# EasyEDA Pro project CHM_A_32 ver1.1.eprj

# Schematic CHM_A_32 ver1.1
Create Date: 2024-05-28; Page Name: CHM_A_32 ver1.1; Project Name: CHM_A_32 ver1.1; Schematic Name: CHM_A_32 ver1.1; Update Date: 2024-06-17; Company: 嘉立创EDA; Page Size: A4; Version: V1.0
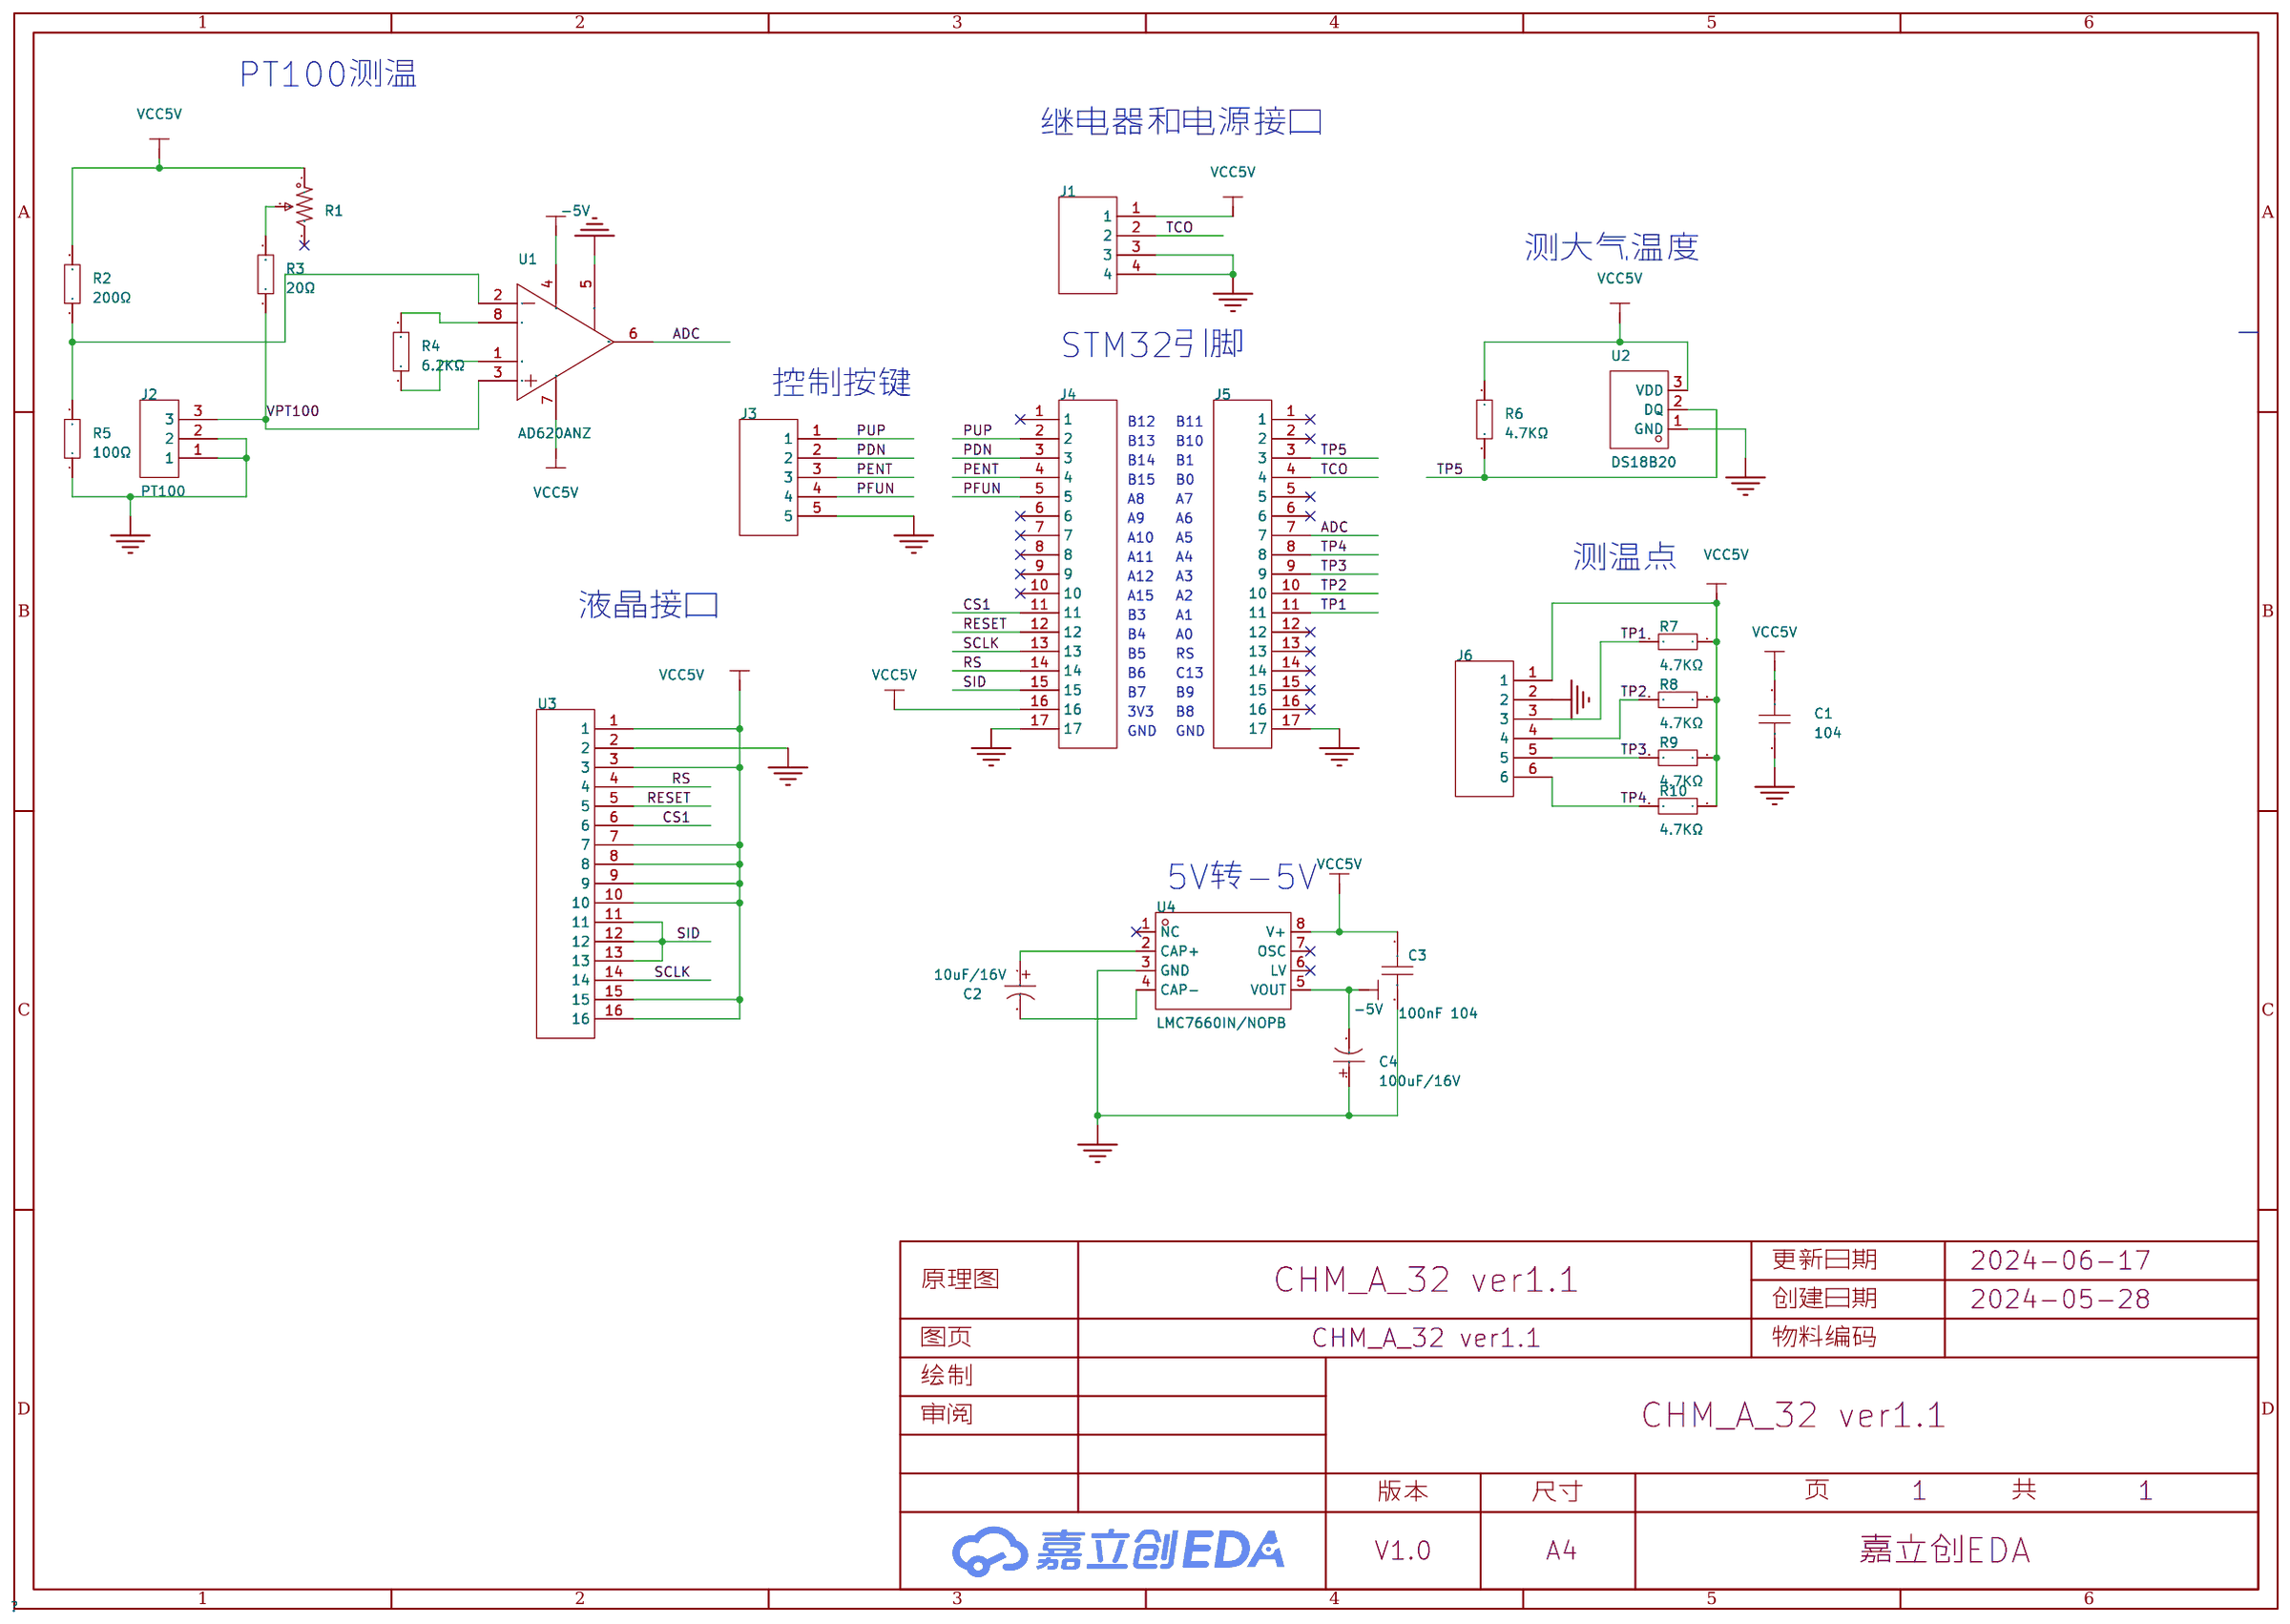
[diagram p0: schematic sheet]

## Parts
C1  104  [280*100mil]
C2  10uF/16V  [280*100mil]
C3  100nF 104  [280*100mil]
C4  100uF/16V  [280*100mil]
J1  -  [CH2.54-4P]
J2  PT100  [CH2.54-3P]
J3  -  [CH2.54-5P]
J4  -  [CH2.54-17P]
J5  -  [CH2.54-17P]
J6  -  [CH2.54-6P]
R1  ？  [电位器]
R2  200Ω  [240*80mil]
R3  20Ω  [240*80mil]
R4  6.2KΩ  [240*80mil]
R5  100Ω  [240*80mil]
R6  4.7KΩ  [240*80mil]
R7  4.7KΩ  [240*80mil]
R8  4.7KΩ  [240*80mil]
R9  4.7KΩ  [240*80mil]
R10  4.7KΩ  [240*80mil]
U1  AD620ANZ  [DIP-8_L9.3-W6.4-P2.54-LS7.6-BL]
U2  DS18B20  [TO-92-3_L4.9-W3.7-P1.27-L]
U3  -  [CH2.54-16P]
U4  LMC7660IN/NOPB  [PDIP-8_L9.6-W6.4-P2.54-LS7.6-BL]

## Library data of the parts
C1 = 插件电容
C2 = RVT1C100M0405: 容值:10uF;精度:±20%;额定电压:16V;纹波电流:-;等效串联电阻:-;; LCSC Part Name: 10uF ±20% 16V; Supplier Part: C3357; Manufacturer: HONOR(荣誉); Supplier Footprint: SMD,D4xL5.4mm; JLCPCB Part Class: 扩展库; Datasheet: https://atta.szlcsc.com/upload/public/pdf/source/20210521/C113284_25C86AE95FB541053FE695F13EA8E7D0.pdf; Supplier: LCSC; Tolerance: ±20%; Rated Voltage: 16V; φD: 4mm; L: 5.4mm; Lifetime @ Temp: 2000hrs@105℃; Operating Temperature: -55℃~+105℃
C3 = CL05B104KB54PNC: 容值:100nF;精度:±10%;额定电压:50V;材质(温度系数):X7R;; LCSC Part Name: 100nF ±10% 50V; Supplier Part: C307331; Manufacturer: SAMSUNG(三星); Supplier Footprint: 0402; JLCPCB Part Class: 基础库; Datasheet: https://atta.szlcsc.com/upload/public/pdf/source/20160218/1457707763339.pdf; Supplier: LCSC; Tolerance: ±10%; Voltage Rated: 50V; Temperature Coefficient: X7R
C4 = RVT1C101M0605: 容值:100uF;精度:±20%;额定电压:16V;纹波电流:-;等效串联电阻:-;; LCSC Part Name: 100uF ±20% 16V; Supplier Part: C37308; Manufacturer: HONOR(荣誉); Supplier Footprint: SMD,D6.3xL5.4mm; JLCPCB Part Class: 扩展库; Datasheet: https://atta.szlcsc.com/upload/public/pdf/source/20210521/C113284_25C86AE95FB541053FE695F13EA8E7D0.pdf; Supplier: LCSC; Tolerance: ±20%; Rated Voltage: 16V; φD: 6.3mm; L: 5.4mm; Lifetime @ Temp: 2000hrs@105℃; Operating Temperature: -55℃~+105℃
J1 = HDR-4P
J2 = HDR-3P
J3 = HDR-5P
J4 J5 = HDR-17P
J6 = HDR-6P
R1 = 3296W-1-103: 阻值:10kΩ;精度:±10%;; LCSC Part Name: 10kΩ ±10%; Supplier Part: C118954; Manufacturer: BOCHEN(博晨); Supplier Footprint: 插件; Datasheet: https://atta.szlcsc.com/upload/public/pdf/source/20171114/C118954_15106326646611117443.pdf; Supplier: LCSC; Tolerance: ±10%
R2-R10 = 插件电阻
U1 = AD620ANZ: 放大器数:单路;输入偏置电流(Ib):500pA;输入失调电压(Vos):30uV;增益带宽积(GBP):-;压摆率(SR):1.2V/us;带宽(-3db):1MHz;; LCSC Part Name: 低成本、低功耗仪表放大器; Supplier Part: C9680; Manufacturer: ADI(亚德诺); Supplier Footprint: DIP-8; JLCPCB Part Class: 扩展库; Datasheet: https://atta.szlcsc.com/upload/public/pdf/source/20121103/1457706545320.pdf; Supplier: LCSC; Number of Circuits: 单路; Current - Input Bias(Ib): 500pA; Voltage - Input Offset(Vos): 30uV; Slew Rate(SR): 1.2V/us; -3db Bandwidth: 1MHz; Operating Temperature: -40℃~+85℃; Check: true
U2 = DS18B20: 温度范围:-55℃~+125℃;精度:±0.4℃;接口类型:-;; Supplier Part: C376006; Manufacturer: UMW(友台半导体); Supplier Footprint: TO-92; JLCPCB Part Class: 扩展库; Datasheet: https://atta.szlcsc.com/upload/public/pdf/source/20231109/DC3DA9D47D486EF40A6E0F08B9A498E3.pdf; Supplier: LCSC; Temperature range: -55℃~+125℃; Resolution: ±0.4℃; Supply Voltage: 3V~5.5V; Check: true
U3 = HDR-16P
U4 = LMC7660IN/NOPB: 功能类型:-;输出类型:固定;输入电压:1.5V~10V;输出电流(最大值):-;; Supplier Part: C1355708; Manufacturer: TI(德州仪器); Supplier Footprint: PDIP-8; JLCPCB Part Class: 扩展库; Datasheet: https://www.ti.com/cn/lit/gpn/lmc7660; Supplier: LCSC; Output Type: 固定; Input Voltage: 1.5V~10V; Switching Frequency: 10kHz; Synchronous Rectification: 否; Number of Outputs: 1; Switch tube (built-in/external): 内置

## Nets
-5V: C4.2 U1.4(-VS) U4.5(VOUT)
GND: C1.1 C3.2 C4.1 J1.3 J1.4 J2.1 J2.2 J3.5 J4.17 J5.17 J6.2 R5.1 U1.5(REF) U2.1(GND) U3.2 U4.3(GND)
VCC5V: C1.2 C3.1 J1.1 J4.16 J6.1 R1.1 R2.2 R6.1 R7.1 R8.1 R9.1 R10.1 U1.7(+VS) U2.3(VDD) U3.1 U3.3 U3.7 U3.8 U3.9 U3.10 U3.15 U3.16 U4.8(V+)
ADC: J5.7 U1.6(OUTPUT)
CS1: J4.11 U3.6
PDN: J3.2 J4.3
PENT: J3.3 J4.4
PFUN: J3.4 J4.5
PUP: J3.1 J4.2
RESET: J4.12 U3.5
RS: J4.14 U3.4
SCLK: J4.13 U3.14
SID: J4.15 U3.11 U3.12 U3.13
TCO: J1.2 J5.4
TP1: J5.11 J6.3 R7.2
TP2: J5.10 J6.4 R8.2
TP3: J5.9 J6.5 R9.2
TP4: J5.8 J6.6 R10.2
TP5: J5.3 R6.2 U2.2(DQ)
VPT100: J2.3 R3.1 U1.3(+IN)
$1N9698: R1.2 R3.2
$1N10699: R2.1 R5.2 U1.2(-IN)
$1N11097: R4.2 U1.8(RG)
$1N11102: R4.1 U1.1(RG)
$1N11673: C2.1 U4.2(CAP+)
$1N11675: C2.2 U4.4(CAP-)

Not connected (* = marked no-connect by the designer): J4 1* 6* 7* 8* 9* 10*; J5 1* 2* 5* 6* 12* 13* 14* 15* 16*; R1 3*; U4 1(NC)* 6(LV)* 7(OSC)*

## Notes on the sheet
- PT100测温
- 继电器和电源接口
- 测大气温度
- STM32引脚
- 控制按键
- B12
- B11
- B13
- B10
- B14
- B1
- B15
- B0
- A8
- A9
- A6
- A7
- A10
- A5
- A11
- A4
- A12
- A3
- 测温点
- A15
- A2
- 液晶接口
- B3
- A1
- B4
- B5
- A0
- RS
- B6
- C13
- B7
- B9
- 3V3
- B8
- GND
- GND
- 5V转-5V

# Board CHM_A_32 ver1.1
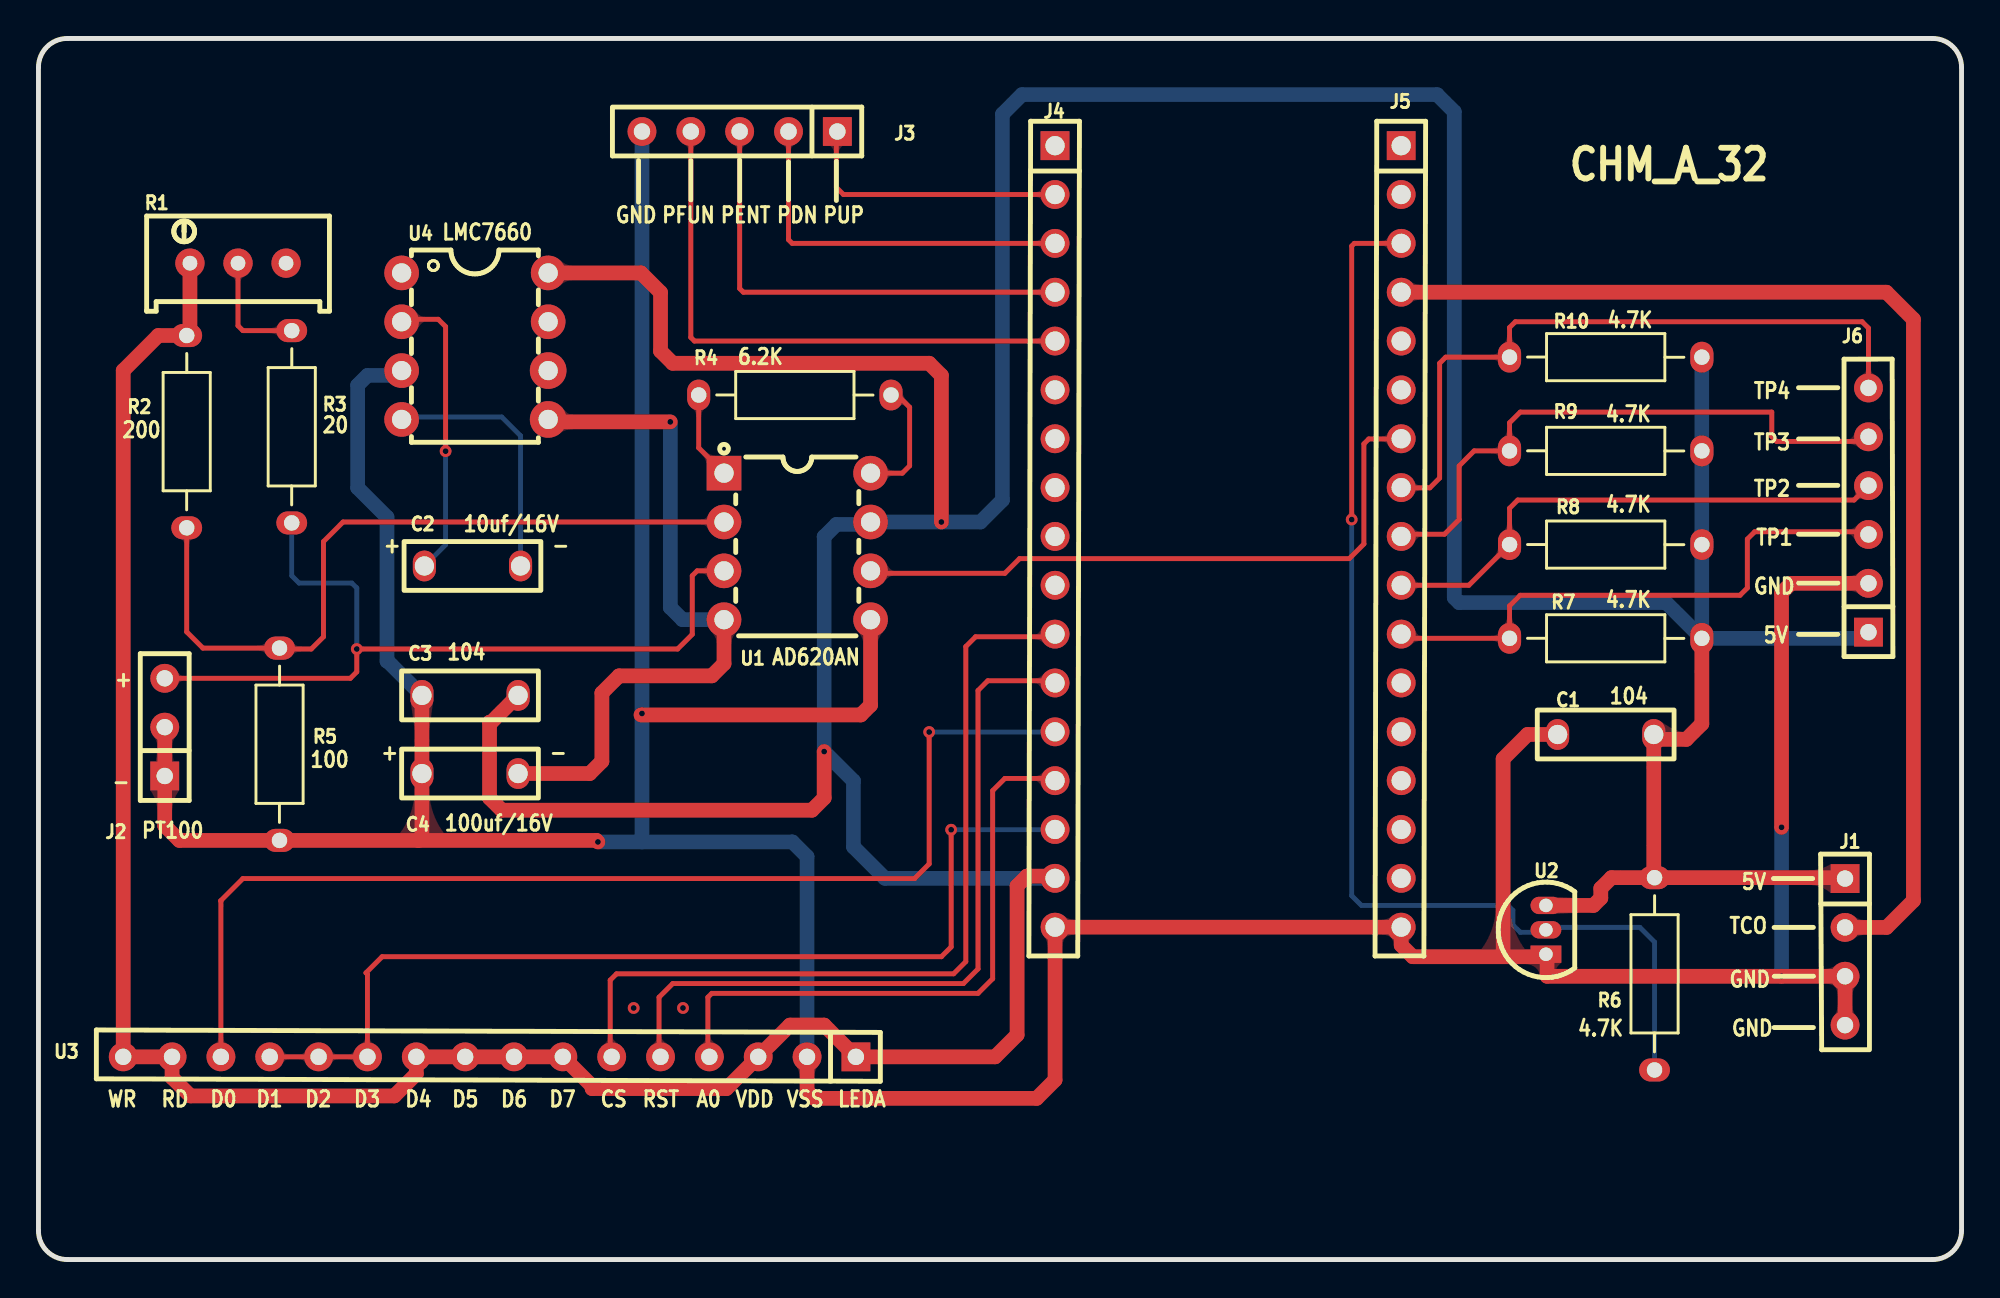
[diagram p1: board, top side]
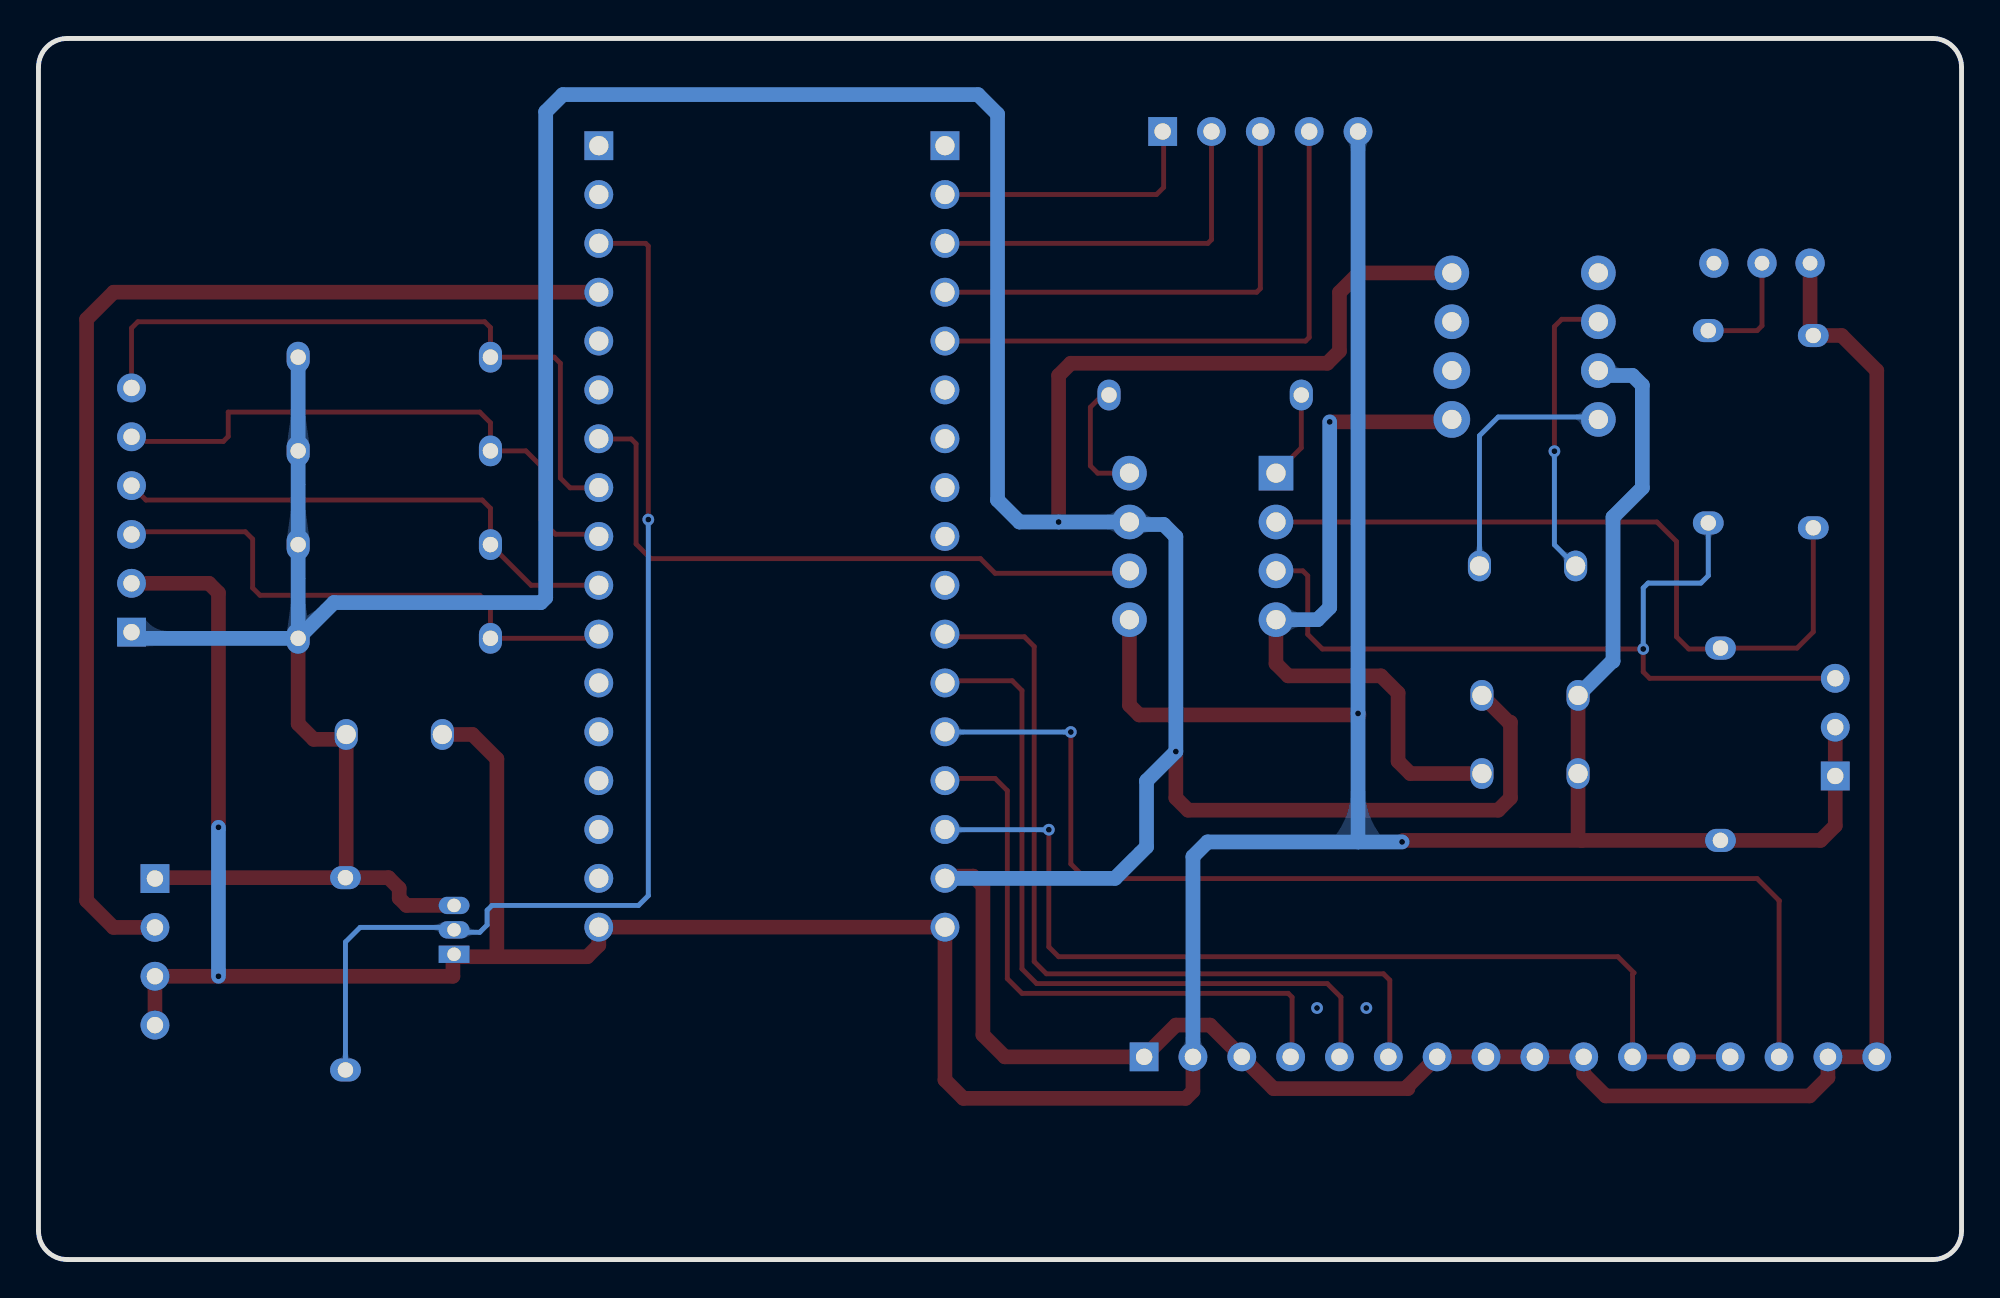
[diagram p2: board, bottom side, seen from below]

Outline 100 x 63.5 mm; copper layers: Top Layer, Bottom Layer. Coordinates in mm from the lower left corner of the outline.
Outline path: 0,62 0,1.5 arc(0.44,0.44) 1.5,0 98.5,0 arc(99.56,0.44) 100,1.5 100,62 arc(99.56,63.06) 98.5,63.5 1.5,63.5 arc(0.44,63.06) 0,62
Stack: Top Layer 0.035mm / Dielectric1 1.51mm FR4 er 4.5 / Bottom Layer 0.035mm

## Design rules (mm)
template: 自定义配置
spacing copperThickness1oz (default): track to track 0.203, other pairs 0.203 to 0.203
spacing copperThickness2oz: track to track 0.203, other pairs 0.152 to 0.3
track width copperThickness1oz (default): min 0.254, default 0.254, max 2.54
track width copperThickness2oz: min 0.203, default 0.254, max 2.54
track width trackWidth1: min 0.254, default 0.762, max 2.54
differential pair differentialPair (default): width min 0.127, default 0.254, max 2.54; gap min 0.152, default 0.152
via viaSize (default): diameter min 0.5, default 0.61, max 10; hole min 0.3, default 0.305, max 6.299
net GND uses trackWidth1
net VCC5V uses trackWidth1

## Placement (name value [footprint] x y rotation side)
C1  104  [280*100mil]  81.5 27.31 0 top
C2  10uF/16V  [280*100mil]  22.57 36.07 0 top
C3  100nF 104  [280*100mil]  22.44 29.34 180 top
C4  100uF/16V  [280*100mil]  22.44 25.27 0 top
J1  -  [CH2.54-4P]  93.81 16 270 top
J2  PT100  [CH2.54-3P]  6.57 27.69 90 top
J3  -  [CH2.54-5P]  36.41 58.67 180 top
J4  -  [CH2.54-17P]  52.81 37.59 270 top
J5  -  [CH2.54-17P]  70.81 37.59 270 top
J6  -  [CH2.54-6P]  95.21 38.99 90 top
R1  ？  [电位器]  10.38 51.82 0 top
R2  200Ω  [240*80mil]  7.71 43.05 90 top
R3  20Ω  [240*80mil]  13.17 43.31 90 top
R4  6.2KΩ  [240*80mil]  39.33 44.96 0 top
R5  100Ω  [240*80mil]  12.53 26.8 90 top
R6  4.7KΩ  [240*80mil]  84.04 14.86 270 top
R7  4.7KΩ  [240*80mil]  81.5 32.31 180 top
R8  4.7KΩ  [240*80mil]  81.5 37.18 180 top
R9  4.7KΩ  [240*80mil]  81.5 42.05 180 top
R10  4.7KΩ  [240*80mil]  81.5 46.93 180 top
U1  AD620ANZ  [DIP-8_L9.3-W6.4-P2.54-LS7.6-BL]  39.46 37.08 270 top
U2  DS18B20  [TO-92-3_L4.9-W3.7-P1.27-L]  78.39 17.14 90 top
U3  -  [CH2.54-16P]  23.46 10.54 180 top
U4  LMC7660IN/NOPB  [PDIP-8_L9.6-W6.4-P2.54-LS7.6-BL]  22.69 47.5 270 top

## Footprints (pads in the part's own frame, mm; a bottom-side part is the same pattern mirrored in y, then rotated)
240*80mil
  oval 1.2x1.6 hole 0.8: 1(-5,0) 2(5,0)
280*100mil
  oval 1.2x1.6 hole 1x0.8: 1(-2.5,0) 2(2.5,0)
CH2.54-3P
  rect 1.5x1.5 hole 0.85: 1(-2.54,0)
  round 1.5 hole 0.85: 2(0,0) 3(2.54,0)
CH2.54-4P
  rect 1.5x1.5 hole 0.85: 1(-3.81,0.127)
  round 1.5 hole 0.85: 2(-1.27,0.127) 3(1.27,0.127) 4(3.81,0.127)
CH2.54-5P
  rect 1.5x1.5 hole 0.85: 1(-5.131,0.013)
  round 1.5 hole 0.85: 2(-2.591,0.013) 3(-0.051,0.013) 4(2.489,0.013) 5(5.029,0.013)
CH2.54-6P
  rect 1.5x1.5 hole 0.85: 1(-6.362,0.051)
  round 1.5 hole 0.85: 2(-3.822,0.051) 3(-1.282,0.051) 4(1.258,0.051) 5(3.797,0.051) 6(6.338,0.051)
CH2.54-16P
  rect 1.5x1.5 hole 0.85: 1(-19.05,0)
  round 1.5 hole 0.85: 2(-16.51,0) 3(-13.97,0) 4(-11.43,0) 5(-8.89,0) 6(-6.35,0) 7(-3.81,0) 8(-1.27,0) 9(1.27,0) 10(3.81,0) 11(6.35,0) 12(8.89,0) 13(11.43,0) 14(13.97,0) 15(16.51,0) 16(19.05,0)
CH2.54-17P
  rect 1.5x1.5 hole 1: 1(-20.332,0.051)
  round 1.5 hole 1: 2(-17.793,0.051) 3(-15.252,0.051) 4(-12.713,0.051) 5(-10.172,0.051) 6(-7.633,0.051) 7(-5.093,0.051) 8(-2.553,0.051) 9(-0.013,0.051) 10(2.527,0.051) 11(5.067,0.051) 12(7.607,0.051) 13(10.148,0.051) 14(12.688,0.051) 15(15.227,0.051) 16(17.767,0.051) 17(20.308,0.051)
DIP-8_L9.3-W6.4-P2.54-LS7.6-BL
  rect 1.8x1.8 hole 1: 1(-3.81,-3.81)
  round 1.8 hole 1: 2(-1.27,-3.81) 3(1.27,-3.81) 4(3.81,-3.81) 5(3.81,3.81) 6(1.27,3.81) 7(-1.27,3.81) 8(-3.81,3.81)
PDIP-8_L9.6-W6.4-P2.54-LS7.6-BL
  round 1.8 hole 1: 1(-3.81,-3.81) 2(-1.27,-3.81) 3(1.27,-3.81) 4(3.81,-3.81) 7(-1.27,3.81) 8(-3.81,3.81)
  round 1.905 hole 1: 5(3.81,3.81) 6(1.27,3.81)
TO-92-3_L4.9-W3.7-P1.27-L
  rect 0.9x1.6 hole 0.7: 1(-1.27,0)
  oval 0.9x1.6 hole 0.7: 2(0,0) 3(1.27,0)
电位器
  round 1.524 hole 0.762: 1(-2.5,0) 2(0,0) 3(2.5,0)

## Nets
As in the schematic.

Pads without a net: J4 1 6 7 8 9 10; J5 1 2 5 6 12 13 14 15 16; R1 3; U4 1 6 7

## Via types
v1: diameter 0.61, hole 0.305, Top Layer to Bottom Layer, 14 vias

## Routing (per net, layer and track width the routed paths; a pad name or vN(x,y) marks a point on that pad's centre or on a via; arc(x,y) is an arc through that point)
-5V: length 36.6
  Top Layer w0.762: U1.4 35.65,30.99 35.01,30.35 30.19,30.35 29.3,29.46 29.3,25.91 28.66,25.27 C4.2 ; U4.5 26.63,43.56 v1(32.85,43.56)
  Bottom Layer w0.762: U1.4 33.49,33.27 32.85,33.91 v1(32.85,43.56)
GND: length 238.4
  Top Layer w0.762: 19.76,21.8 19.94,21.98 C4.1 C3.2 ; 19.76,21.8 R5.1 7.33,21.8 6.57,22.56 J2.1 J2.2 ; 19.76,21.8 29.01,21.8 v1(29.09,21.72) ; 76.15,15.75 76.16,15.76 76.16,26.03 77.43,27.31 C1.1 ; 76.15,15.75 78.26,15.75 U2.1 78.45,15.81 78.45,14.73 v1(90.64,14.73) J1.3 J1.4 ; 76.15,15.75 71.46,15.75 70.86,16.35 J5.17 J4.17 52.86,9.34 51.91,8.38 40.35,8.38 39.97,8.76 39.97,10.54 ; U1.5 43.27,28.83 42.76,28.32 31.33,28.32 ; J6.2 91.14,35.17 90.64,34.67 v1(90.64,22.48)
  Bottom Layer w0.762: U4.3 18.63,45.97 17.11,45.97 16.6,45.47 16.6,40.13 18.12,38.61 18.12,31.11 18.16,31.11 C3.2 ; 31.38,21.72 v1(31.38,28.4) J3.5 ; 31.38,21.72 v1(29.09,21.72) ; 31.38,21.72 39.21,21.72 39.97,20.95 39.97,10.45 ; v1(90.64,14.73) v1(90.64,22.48)
  vias: v1(30.95,13.08) v1(33.52,13.08)
VCC5V: length 340.6
  Top Layer w0.762: C3.1 23.54,27.94 23.46,27.94 23.46,24 24.09,23.37 40.22,23.37 40.86,24 v1(40.86,26.42) ; v1(46.95,38.35) 46.95,45.97 46.32,46.61 32.98,46.61 32.35,47.24 32.35,50.29 31.33,51.31 U4.8 ; R6.1 93.9,19.86 J1.1 ; R6.1 84,19.9 C1.2 84.25,27.05 85.69,27.05 86.5,27.86 R7.1 ; R6.1 81.8,19.86 81.24,19.3 81.24,18.8 80.86,18.42 U2.3 ; R1.1 7.88,48.22 R2.2 6.23,48.05 4.41,46.23 U3.16 6.95,10.54 6.95,9.46 7.9,8.51 18.5,8.51 19.65,9.65 19.65,10.54 U3.9 U3.7 28.79,9.02 28.79,8.89 35.78,8.89 U3.3 39.08,12.19 40.86,12.19 U3.1 49.75,10.54 50.89,11.68 50.89,19.43 51.4,19.94 52.75,19.94 J4.16
  Bottom Layer w0.762: R7.1 94.84,32.31 J6.1 ; R7.1 R8.1 R9.1 R10.1 ; R7.1 84.64,34.16 73.88,34.16 73.62,34.42 73.62,59.69 72.73,60.58 51.14,60.58 50.13,59.56 50.13,39.5 48.98,38.35 v1(46.95,38.35) U1.7 43.14,38.23 41.49,38.23 40.86,37.59 v1(40.86,26.42) 42.38,24.89 42.38,21.46 44.02,19.82 J4.16
ADC: length 34.1
  Top Layer w0.254: 43.14,35.69 50.25,35.69 51.02,36.45 68.16,36.45 68.92,37.21 68.92,42.42 69.18,42.67 70.85,42.67 J5.7 ; 43.14,35.69 42.89,35.69 ; 43.14,35.69 U1.6
CS1: length 44.2
  Top Layer w0.254: U3.6 29.73,10.62 29.73,14.53 30.06,14.86 47.59,14.86 48.22,15.49 48.22,31.88 48.73,32.39 52.72,32.39 J4.11
PDN: length 19.6
  Top Layer w0.254: J3.2 39,53.03 39.19,52.84 J4.3
PENT: length 24.6
  Top Layer w0.254: J3.3 36.46,50.5 36.65,50.3 J4.4
PFUN: length 29.7
  Top Layer w0.254: J4.5 34.11,47.76 33.92,47.95 J3.4
PUP: length 14.5
  Top Layer w0.254: J3.1 41.49,58.61 41.49,55.75 41.86,55.38 J4.2
RESET: length 39.1
  Top Layer w0.254: 32.35,10.54 32.27,10.62 32.27,13.64 32.98,14.35 48.09,14.35 48.86,15.11 48.86,29.59 49.37,30.1 52.75,30.1 J4.12
RS: length 31.7
  Top Layer w0.254: U3.4 34.81,10.62 34.81,13.64 35.01,13.84 48.86,13.84 49.62,14.61 49.62,24.38 50.25,25.02 52.75,25.02 J4.14
SCLK: length 59.2
  Top Layer w0.254: v1(46.32,27.43) 46.32,20.57 45.56,19.81 10.63,19.81 9.47,18.66 9.49,18.64 U3.14
  Bottom Layer w0.254: J4.13 52.85,27.43 v1(46.32,27.43)
SID: length 52
  Top Layer w0.254: v1(47.46,22.35) 47.46,16.26 46.95,15.75 17.87,15.75 17.03,14.91 17.11,14.83 U3.11 U3.12 12.03,10.54
  Bottom Layer w0.254: J4.15 52.85,22.35 v1(47.46,22.35)
TCO: length 61.6
  Top Layer w0.762: J1.2 96.1,17.27 97.5,18.67 97.5,48.89 96.09,50.3 J5.4
TP1: length 29.2
  Top Layer w0.254: J6.3 95.02,37.85 89.24,37.85 88.86,37.47 88.86,34.92 88.48,34.54 77.05,34.54 76.5,33.99 R7.2 71.08,32.31 J5.11
TP2: length 27.6
  Top Layer w0.254: J6.4 94.41,39.5 76.92,39.5 76.5,39.07 R8.2 74.38,35.06 J5.10
TP3: length 30.9
  Top Layer w0.254: J5.9 70.98,37.72 73.11,37.72 73.88,38.48 73.88,41.28 74.65,42.05 R9.2 76.5,43.51 77.05,44.07 90.13,44.07 90.13,42.8 90.39,42.55 94.92,42.55 J6.5
TP4: length 35.5
  Top Layer w0.254: J6.6 95.16,48.44 94.83,48.77 76.8,48.77 76.5,48.47 R10.2 73.18,46.93 72.86,46.61 72.86,40.64 72.35,40.13 70.87,40.13 J5.8
TP5: length 60.5
  Top Layer w0.254: v1(68.29,38.48) 68.29,52.7 68.43,52.84 J5.3
  Bottom Layer w0.254: R6.2 84.04,16.51 83.27,17.27 78.51,17.27 U2.2 78.26,17.02 77.05,17.02 76.67,17.4 76.67,18.16 76.42,18.42 68.8,18.42 68.29,18.92 v1(68.29,38.48)
VPT100: length 43.4
  Top Layer w0.254: U1.3 34.25,35.81 34,35.56 34,32.51 33.24,31.75 v1(16.55,31.75) 16.55,30.56 16.22,30.23 J2.3
  Bottom Layer w0.254: R3.1 13.17,35.56 13.55,35.18 16.3,35.18 16.55,34.92 v1(16.55,31.75)
$1N9698: length 6.2
  Top Layer w0.254: R1.2 10.38,48.56 10.63,48.31 R3.2
$1N10699: length 39.4
  Top Layer w0.254: R2.1 7.71,32.64 8.55,31.8 R5.2 12.58,31.75 14.19,31.75 14.82,32.39 14.82,37.34 15.84,38.35 U1.2
$1N11097: length 6.5
  Top Layer w0.254: R4.2 44.67,44.96 45.3,44.32 45.3,41.28 44.92,40.89 U1.8
$1N11102: length 4.6
  Top Layer w0.254: U1.1 34.33,42.21 R4.1
$1N11673: length 15.4
  Top Layer w0.254: U4.2 19.01,48.89 20.79,48.89 21.17,48.51 v1(21.17,42.04)
  Bottom Layer w0.254: v1(21.17,42.04) 21.17,37.17 C2.1
$1N11675: length 13.4
  Bottom Layer w0.254: U4.4 19.01,43.81 24.09,43.81 25.07,42.84 C2.2

## Copper pours and planes (outline as drawn; the poured copper is in the pictures)
GND on Top Layer: -6.64,68.71 109.31,68.71 109.31,-9.78 -6.64,-9.78
GND on Bottom Layer: -10.83,70.87 106.51,70.87 106.51,-6.73 -10.83,-6.73

Small or netless copper shapes (teardrops, artwork), in the pictures only: 98 on Top Layer, 32 on Bottom Layer

## Text on the board
Top Silkscreen Layer: 100uf/16V | 10uf/16V | 6.2K | 104 | WR | RD | D0 | D1 | D2 | D3 | D4 | D5 | D6 | D7 | CS | RST | A0 | VDD | VSS | PUP | LEDA | 4.7K | TCO | GND | 5V | TP4 | TP3 | TP2 | TP1 | + | LMC7660 | - | PFUN | PENT | AD620AN | PDN | 200 | PT100 | 100 | 20 | CHM_A_32
